# EAGLE design w6_echo_plus (EAGLE 9.0.1)
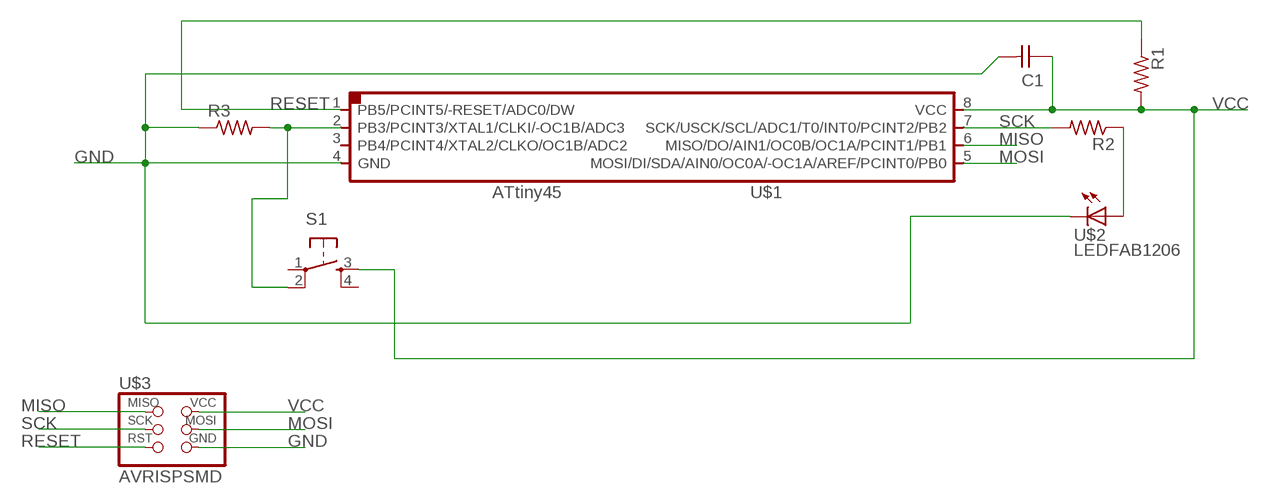
[diagram p0: schematic, sheet 1]

## Parts
C1  CAP-UNPOLARIZEDFAB  [C1206FAB]
R1  RES-US1206FAB  [R1206FAB]
R2  RES-US1206FAB  [R1206FAB]
R3  RES-US1206FAB  [R1206FAB]
S1  6MM_SWITCH6MM_SWITCH  [6MM_SWITCH]
U$1  ATTINY45SI  [SOIC8]
U$2  LEDFAB1206  [LED1206FAB]
U$3  AVRISPSMD  [2X03SMD]

## Nets
GND: C1.2 R3.1 U$1.4(GND) U$2.2(C) U$3.6(GND)
MISO: U$1.6(MISO/DO/AIN1/OC0B/OC1A/PCINT1/PB1) U$3.1(MISO)
MOSI: U$1.5(MOSI/DI/SDA/AIN0/OC0A/-OC1A/AREF/PCINT0/PB0) U$3.4(MOSI)
N$1: R3.2 S1.2(P1) U$1.2(PB3/PCINT3/XTAL1/CLKI/-OC1B/ADC3)
N$4: R2.1 U$2.1(A)
RESET: R1.1 U$1.1(PB5/PCINT5/-RESET/ADC0/DW) U$3.5(RST)
SCK: R2.2 U$1.7(SCK/USCK/SCL/ADC1/T0/INT0/PCINT2/PB2) U$3.3(SCK)
VCC: C1.1 R1.2 S1.3(S) U$1.8(VCC) U$3.2(VCC)
Unconnected: S1.1(P) S1.4(S1) U$1.3(PB4/PCINT4/XTAL2/CLKO/OC1B/ADC2)

## Library data of the parts
C1 = fab:CAP-UNPOLARIZED
R1-R3 = fab:RES-US: Resistor (US Symbol) Variants with postfix FAB are widened to allow the routing of internal traces
S1 = fab:6MM_SWITCH: OMRON SWITCH
U$1 = fab:ATTINY45
U$2 = fab:LED: LED
U$3 = fab:AVRISP

## Board
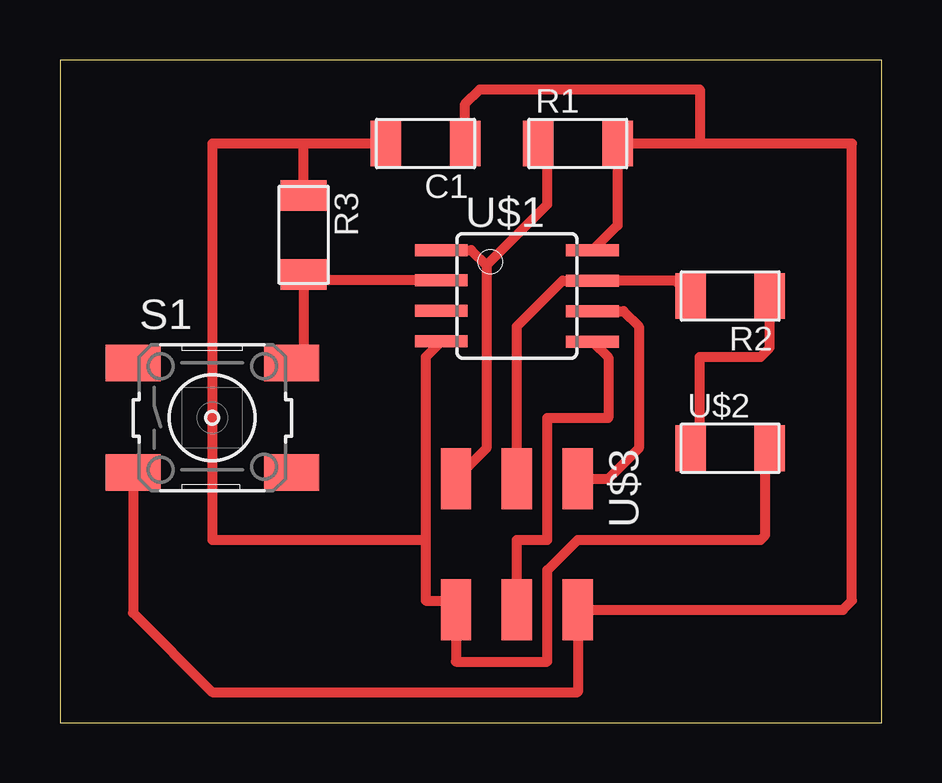
[diagram p1: board, top side]

Size 34.27 x 27.61 mm. Coordinates in mm from the lower left corner, seen from the top.
Outline: 0,0 34.27,0 34.27,27.61 0,27.61 0,0
Copper layers (1*16): Top 0.035mm / dielectric 1.5mm / Bottom 0.035mm
Design rules "fabmodule": minimum track width 10mil, minimum drill 0.4mm, track to track 0.42mm, track to pad 0.42mm, pad to pad 0.42mm, via to via 0.42mm, smd to smd 0.42mm, copper to edge 40mil, drill to drill 0.8mm, minimum pad ring 10mil, minimum via ring 8mil, stop-mask expansion 4mil, vias tented up to drill 0mil, thermal gap 10mil

### Footprints (pad centres in the part's own frame; a part is rotated, then mirrored left to right if it is on the bottom)
C1206FAB = smd 1.27 x 1.905: 1 -1.651,0; 2 1.651,0
R1206FAB = smd 1.27 x 1.905: 1 -1.651,0; 2 1.651,0
6MM_SWITCH = smd 2.286 x 1.524: 1 -3.302,2.286; 2 3.302,2.286; 3 -3.302,-2.286; 4 3.302,-2.286
SOIC8 = smd 0.5 x 2.2: 1 -1.905,-3.154; 2 -0.645,-3.154; 3 0.625,-3.154; 4 1.895,-3.154; 5 1.905,3.154; 6 0.635,3.154; 7 -0.635,3.154; 8 -1.905,3.154
LED1206FAB = smd 1.27 x 1.905: 1 -1.651,0; 2 1.651,0
2X03SMD = smd 2.54 x 1.27: 1 -2.54,2.54; 2 2.92,2.54; 3 -2.54,0; 4 2.92,0; 5 -2.54,-2.54; 6 2.92,-2.54

### Placement (x,y rotation side)
C1  15.24,24.13 180 top
R1  21.59,24.13 0 top
R2  27.94,17.78 180 top
R3  10.16,20.32 270 top
S1  6.35,12.7 0 top
U$1  19.05,17.78 270 top
U$2  27.94,11.43 0 top
U$3  19.05,7.62 270 top

### Tracks (layer width: path | path; a pad name or v marks a point on that pad's centre or on a via)
GND
  Top 0.406: U$2.2 29.4,11.24 | 29.4,11.24 29.21,11.05 | U$1.4 15.24,15.23 15.24,7.62 | 15.24,7.62 15.24,5.08 16.13,5.08 U$3.6 16.51,2.54 20.32,2.54 20.32,6.35 21.59,7.62 29.21,7.62 29.4,7.81 29.4,11.24 | 15.24,7.62 6.35,7.62 6.35,24.13 10.16,24.13 | C1.2 10.16,24.13 | R3.1 10.16,24.13
MISO
  Top 0.406: U$3.1 22.86,10.16 24.13,11.43 24.13,16.51 23.5,17.14 U$1.6
MOSI
  Top 0.406: U$1.5 22.86,15.22 22.86,12.7 20.32,12.7 20.32,7.62 19.05,7.62 U$3.4
N$1
  Top 0.406: S1.2 10.16,15.49 R3.2 10.4,18.43 U$1.2
N$4
  Top 0.406: U$2.1 26.67,11.81 26.67,15.24 29.21,15.24 29.59,15.62 R2.1
RESET
  Top 0.406: U$3.5 17.78,11.43 17.78,19.05 | U$1.1 17.14,19.69 17.78,19.05 | 17.78,19.05 20.32,21.59 20.32,23.75 R1.1
SCK
  Top 0.406: U$3.3 19.05,16.51 20.95,18.41 U$1.7 25.65,18.41 R2.2
VCC
  Top 0.406: 26.67,24.13 33.02,24.13 33.02,5.08 32.64,4.7 U$3.2 21.59,1.27 6.35,1.27 3.05,4.57 S1.3 | 26.67,24.13 R1.2 23.24,20.72 U$1.8 | C1.1 16.89,25.78 17.5,26.39 26.67,26.39 26.67,24.13